# Altium project MEMESAT - PoBoI - Updated LTC.PrjPcb (part 1 of 2)
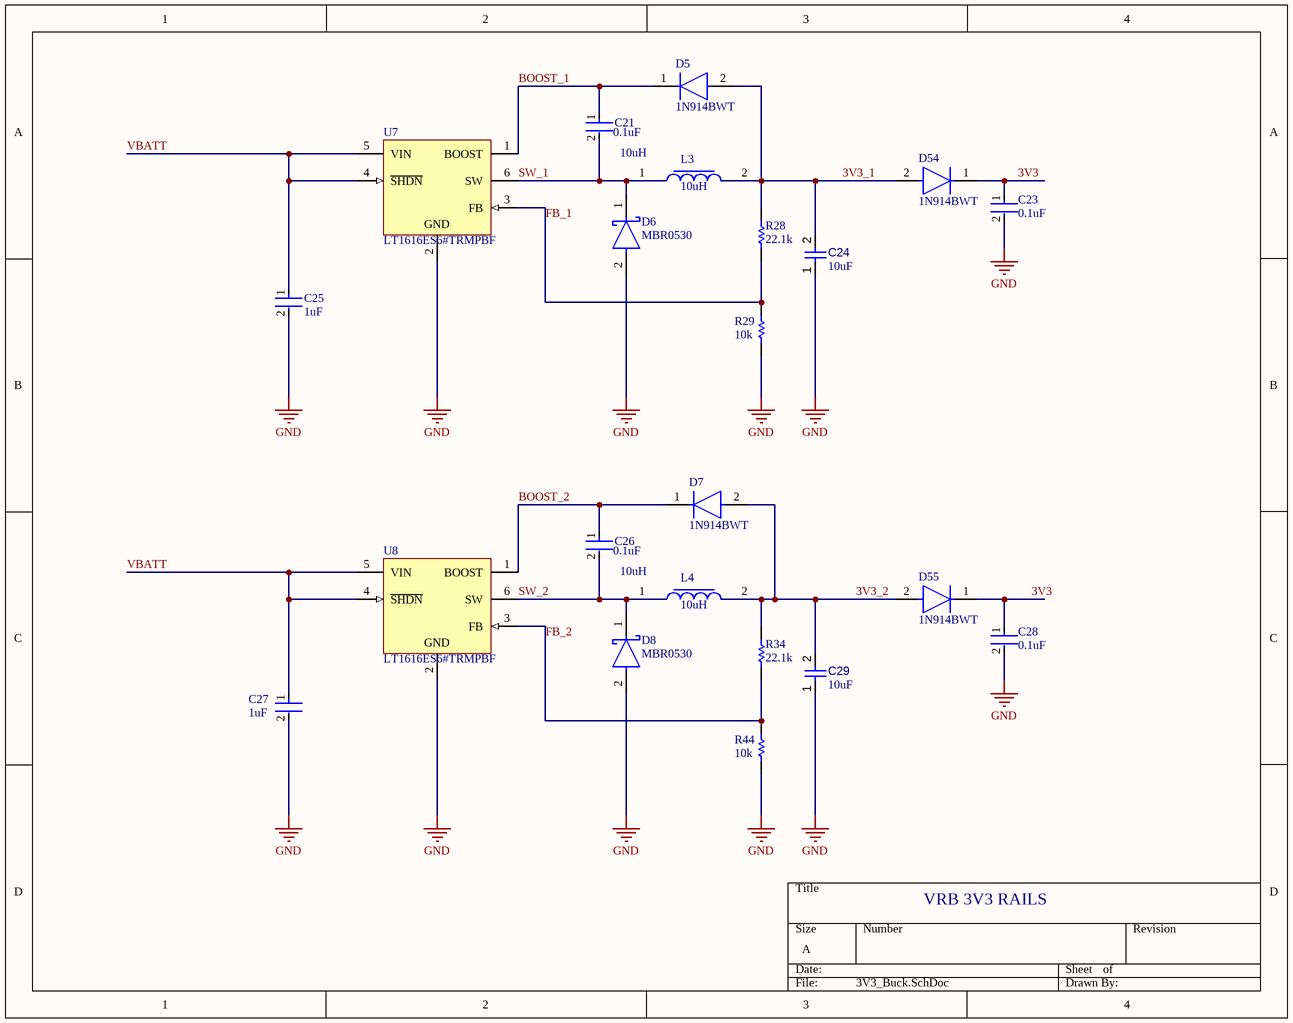
[diagram p0: 3V3_Buck.SchDoc]
12 sheets, 211 parts. Net scope: flat (ports and power ports of the same name join across sheets).
Board file: PoBoI.PcbDoc
Sheets:
  3V3_Buck.SchDoc
  3V3Primary.SchDoc
  3V3Secondary.SchDoc
  5V_Buck.SchDoc
  5VPrimary.SchDoc
  5VSecondary.SchDoc
  MemoryLatch.SchDoc
  PC104.SchDoc
  STM32.SchDoc
  VBATTPrimary.SchDoc
  VBATTSecondary.SchDoc
  WatchDog.SchDoc

## Sheet 3V3_Buck.SchDoc
size A; SheetNumber: 6; SheetTotal: 12; SPICEModelCacheKMHHWGDA: <root> / <DocumentId>KMHHWGDA</DocumentId> / <CacheFrame Number="0"> / <Model Name="lm317" Kind="CKT"> / <Text>*------------------------------------------------- / * POSITIVE ADJUSTABLE VOLTAGE REGULATOR / .SUBCKT LM317 IN ADJ OUT / JADJ IN ADJ ADJ JADJMOD / VREF 4 ADJ 1.250 / DBK IN 13 DMOD / CBC 13 15 800.0E-12 / RBC 15 5 1.000E3 / QPASS 13 5 OUT QPASSMOD / RB1 7 6 1 / RB2 6 5 128.3 / DSC 6 11 DMOD / ESC 11 OUT VALUE={5.646-.6667*V(6,5)*V(13,5)} / DFB 6 12 DMOD / EFB 12 OUT VALUE={8.822-.4024*V(13,5)+5.250E-3*V(13,5)*V(13,5) -.6667*V(13,5)*V(6,5)} / EB 7 OUT 8 OUT 6.939 / RP 9 8 100 / CPZ 10 OUT 3.183E-6 / DPU 10 OUT DMOD / RZ 8 10 .1 / EP 9 OUT 4 OUT 100 / RI OUT 4 100MEG / .MODEL QPASSMOD NPN (IS=30F BF=50 VAF=1.500 NF=1.701) / .MODEL JADJMOD NJF (BETA=50.00E-6 VTO=-1) / .MODEL DMOD D (IS=30F N=1.701) / .ENDS</Text> / </Model> / </CacheFrame> / </root>

### Parts
(Parts that share a designator on the sheet are numbered #1, #2 ... from top to bottom, then left to right.)
C21  0.1uF  [FP-C0603-CJ-MFG]
C23  0.1uF  [FP-C0603-CJ-MFG]
C24  value 10uF  [CAPC0603(1608)100_L]  (hidden comment: Capacitor 10µF +/-20% 10V 0603)
C25  1uF  [FP-CL10-IPC_B]
C26  0.1uF  [FP-C0603-CJ-MFG]
C27  1uF  [FP-CL10-IPC_B]
C28  0.1uF  [FP-C0603-CJ-MFG]
C29  value 10uF  [CAPC0603(1608)100_L]  (hidden comment: Capacitor 10µF +/-20% 10V 0603)
D5  1N914BWT  [FP-502-01-MFG]
D6  MBR0530  [FP-425-04-MFG]
D7  1N914BWT  [FP-502-01-MFG]
D8  MBR0530  [FP-425-04-MFG]
D54  1N914BWT  [FP-502-01-MFG]
D55  1N914BWT  [FP-502-01-MFG]
L3  Inductance: 10uH  [INDM3532X15N]  (hidden comment: PA4547.103NLT)
L4  Inductance: 10uH  [INDM3532X15N]  (hidden comment: PA4547.103NLT)
R28  22.1k  [RESC1609X50X30LL10T20]
R29  10k  [RESC1609X50X30NL8T20]
R34  22.1k  [RESC1609X50X30LL10T20]
R44#1  10k  [RESC1609X50X30NL8T20]
U7  LT1616ES6#TRMPBF  [LT-S6-6-SOT-23_M]
U8  LT1616ES6#TRMPBF  [LT-S6-6-SOT-23_M]

### Nets
GND: C23.2 C24.1 C25.2 C27.2 C28.2 C29.1 D6.2(A) D8.2(A) R29.1 R44#1.1 U7.2(GND) U8.2(GND)
3V3: C23.1 C28.1 D54.1(C) D55.1(C)
3V3_1: C24.2 D5.2(A) D54.2(A) L3.2 R28.2
3V3_2: C29.2 D7.2(A) D55.2(A) L4.2 R34.2
BOOST_1: C21.1 D5.1(C) U7.1(BOOST)
BOOST_2: C26.1 D7.1(C) U8.1(BOOST)
FB_1: R28.1 R29.2 U7.3(FB)
FB_2: R34.1 R44#1.2 U8.3(FB)
SW_1: C21.2 D6.1(C) L3.1 U7.6(SW)
SW_2: C26.2 D8.1(C) L4.1 U8.6(SW)
VBATT: C25.1 C27.1 U7.4(~{SHDN}) U7.5(VIN) U8.4(~{SHDN}) U8.5(VIN)

### Notes on the sheet
- (near L3) 10uH
- (near L4) 10uH
- VRB 3V3 RAILS

### Library data of the parts
C21 C23 C26 C28 = CMP-2006-03300-2: CAP CER 0.1UF 50V X7R 0603 / C0603X104K5RACTU; Manufacturer: Kemet; Capacitance: 100nF; Material: Ceramic; Tolerance: 10%; Value: 100nF; Temperature Coefficient: 15%; Temperature Range High: +125°C; Temperature Range Low: -55°C; Manufacturer Part Number: C0603X104K5RACTU; Voltage: 50V; ComponentLink2Description: Datasheet; RoHS: TRUE; ComponentLink2URL: https://content.kemet.com/datasheets/KEM_C1013_X7R_FT-CAP_SMD.pdf; Device Class L3: Ceramic Capacitors; Device Class L2: Capacitors; Package: C0603-CJ; Height: 0.95mm; Device Class L1: Passive Components; Temperature Characteristic: X7R; Lead Free: Yes; Digikey Description: CAP CER 0.1UF 50V X7R 0603; Automotive: No; Mouser Description: Capacitor; Ceramic; Cap 0.1uF; Tol+10%; SMT; Flexible Termination; Vol-Rtg 50V; TR; Temperature: -55°C to +125°C; Octopart: https://octopart.com/c0603x104k5ractu-kemet-9145062; Category: Cap; Voltage Rating: 50V; Ipc Land Pattern Name: CAPC16080X80
C24 C29 = CMP-001-00075-4: Chip Capacitor, 10µF +/-20%, 10V, 0603, Thickness 1 mm; Tolerance: 10%; Voltage Rating: 10V; Max Operating Temperature: 85°C; Pins: 2; Case/Package: 0603; Mounting Technology: SMT; Min Operating Temperature: -55°C
C25 C27 = CMP-13271-001107-1: Cap Ceramic 1uF 25V X7R ±10% Pad SMD 0603 +125°C T/R; Width: 0.031inch; Voltage Rating: 25V; Length: 0.063inch; Min Operating Temperature: -55°C; Package Quantity: 1; Tolerance: 10%; Case Code (Metric): 1608; Case/Package: 0603; Mount: Surface Mount; Thickness: 0.035inch; Lead Free: Lead Free; Case Code (Imperial): 0603; Capacitance: 1uF; Depth: 0.8mm; Dielectric: X7R; Max Operating Temperature: 125°C; Radiation Hardening: No; Packaging: Tape and Reel; Height: 0.8mm
D5 D7 D54 D55 = CMP-07163-000008-1: DIODE GEN PURP 75V 200MA SOD523F; Manufacturer: ON Semiconductor; Forward Current: 300mA; Capacitance: 4pF; Max Junction Temp: +150°C; Reverse Voltage: 100V; Value: 4pF; Peak Reverse Current: 5uA; ComponentLink2Description: Datasheet; Package: 502-01; Manufacturer Part Number: 1N914BWT; Digikey Description: DIODE GEN PURP 75V 200MA SOD523F; Temperature Range High: +150°C; Temperature: -55°C to +150°C; Footprint Url: https://www.onsemi.com/pub/Collateral/502-01.PDF; Device Class L2: Diodes; Lead Free: Yes; Automotive: No; Category: Diode; Octopart: https://octopart.com/1n914bwt-on+semiconductor-84323166; Device Class L1: Discrete Semiconductors; Ipc Land Pattern Name: SODFL16080X60; Device Class L3: Rectifier Diodes; Height: 0.7mm; Max Repetitive Reverse Voltage: 75V; Mouser Description: Diodes - General Purpose, Power, Switching SINGLE JUNC. 100V 4.0NS COMP; Temperature Range Low: -55°C; ComponentLink2URL: https://www.onsemi.com/pub/Collateral/1N914BWT-D.pdf; RoHS: TRUE
D6 D8 = CMP-2000-05113-2: DIODE SCHOTTKY 30V 500MA SOD123; Polarity: Standard; Max Reverse Leakage Current: 130uA; Forward Voltage: 430mV; Element Configuration: Single; Peak Non-Repetitive Surge Current: 5.5A; REACH SVHC: No SVHC; Contact Plating: Tin; Width: 1.6mm; Weight: 0.03g; Max Reverse Voltage (DC): 30V; Mount: Surface Mount; Max Repetitive Reverse Voltage (Vrrm): 30V; Number of Pins: 2; Height: 1.03mm; Current Rating: 500mA; Max Forward Surge Current (Ifsm): 5.5A; Lead Free: Lead Free; Max Surge Current: 5.5A; Peak Reverse Current: 130uA; Min Operating Temperature: -65°C; Radiation Hardening: No; Max Operating Temperature: 150°C; Average Rectified Current: 500mA; Packaging: Tape and Reel; Length: 2.7mm; Forward Current: 500mA; Voltage Rating (DC): 30V; Package Quantity: 1; Output Current: 500mA; Part Number: *
L3 L4 = CMP-006-00022-2: Inductor Power Molded Wirewound 10uH 20% 100KHz 1.2A 0.522Ohm DCR Automotive T/R; DC Resistance MAX: 522 mOhms; Rated Current: 1.20A; Saturation Current: 1.6A; DC Resistance Typical: 435 mOhms
R28 R34 = CMP-2000-03094-1: Part Number: CRCW060322K1FKEA; Manufacturer: Vishay Dale
R29 R44#1 = CMP-1666-00005-4: Chip Resistor, 10 KOhm, +/- 1%, 100 mW, -55 to 155 degC, 0603 (1608 Metric), RoHS, Tape and Reel / CRCW060310K0FKEA; Manufacturer: Vishay Semiconductor; Voltage Rating: 75 V; Value: 1K; Max Operating Temperature: 155 degC; PackageDescription: 2-Pin Surface Mount Device, Body 1.575 x 0.85 mm; ComponentLink1Description: Manufacturer URL; RoHSCompliant: true; PackageReference: 0603; REACH SVHC: Unknown; Length: 1.55 mm; DatasheetVersion: 06/2012; Packaging: Tape and Reel; Min Operating Temperature: -55 degC; Mounting Technology: Surface Mount; ComponentLink2URL: https://datasheet.ciiva.com/11809/0900766b80d98afc-11809037.pdf; Height: 0.45 mm; ComponentLink2Description: Datasheet; Package Quantity: 5000; ComponentLink1URL: http://www.vishay.com/
U7 U8 = CMP-0491-01627-1: 600 mA, 1.4 MHz Step-Down Switching Regulator, 6-pin SOT23 (S6-6), -40 to 85 degC, Pb-Free, Mini Tape and Reel; Manufacturer: Linear Technology; Number of Outputs: 1; PackageDescription: 6-Pin Plastic SOT-23, Body 1.625 x 2.9 mm, Pitch 0.95 mm; ComponentLink1Description: Manufacturer URL; Mounting Technology: Surface Mount; PackageVersion: Aug-07; ComponentLink3Description: Package Specification; PackageReference: S6-6; RoHS: TRUE; ComponentLink1URL: http://www.linear.com/; ComponentLink2Description: Datasheet; Packing: Mini Tape and Reel; PartNumber: LT1616ES6#TRMPBF; ComponentLink2URL: http://cds.linear.com/docs/en/datasheet/lt1616fs.pdf; ComponentLink3URL: http://cds.linear.com/docs/en/datasheet/175435f.pdf

## Sheet 3V3Primary.SchDoc
size A; SheetNumber: 13; SheetTotal: 18
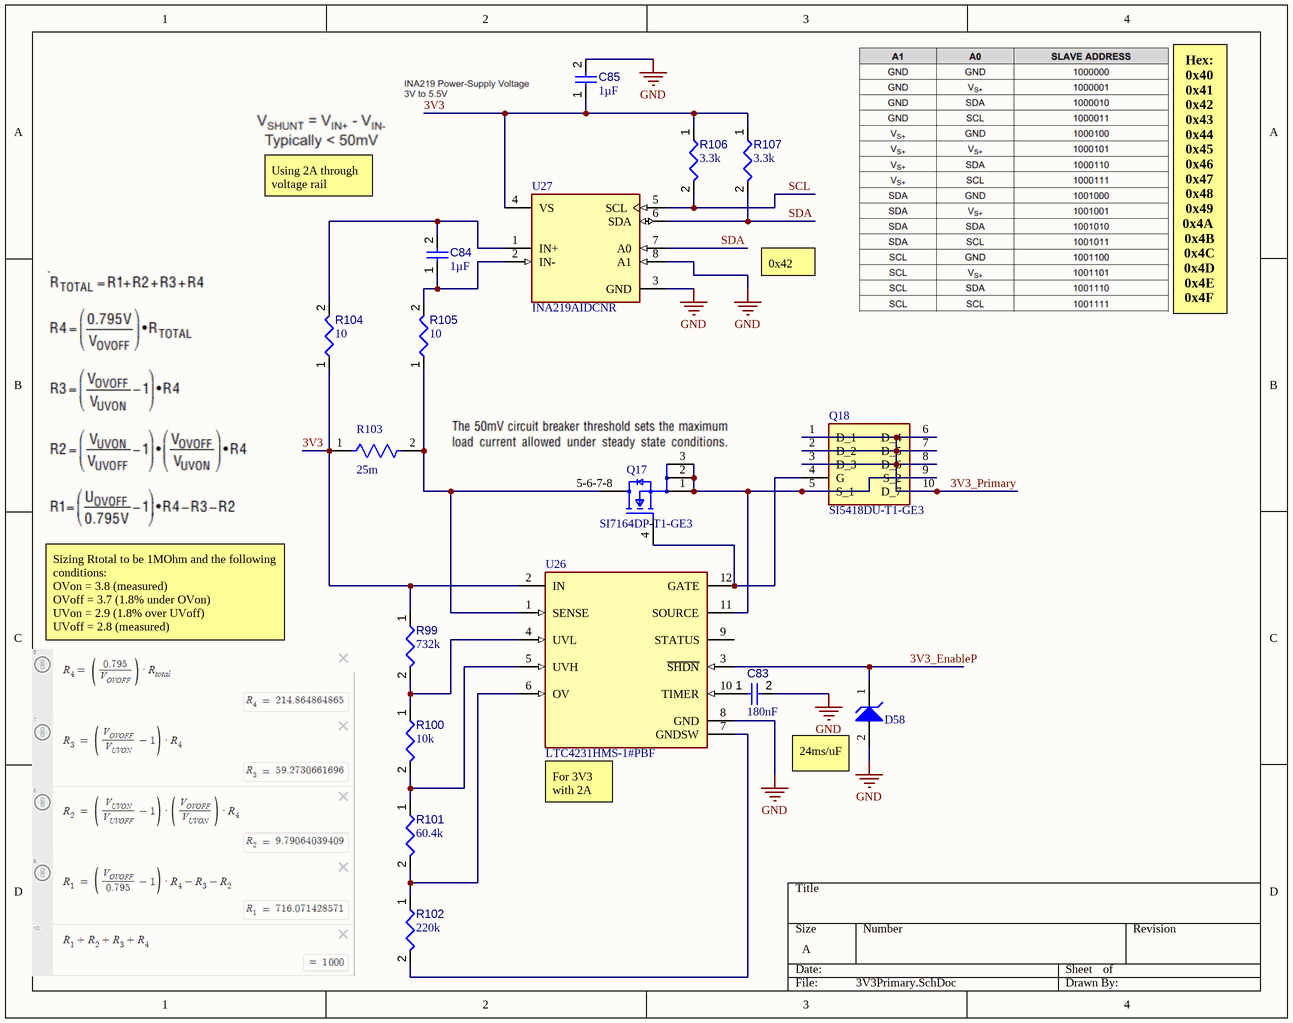
[diagram p1: 3V3Primary.SchDoc]

### Parts
C83  value 180nF  [FP-C0805C-DN-IPC_A]  (hidden comment: C0805C184K5RACTU)
C84  value 1µF  [CAPC1608X90X40LL10T20]  (hidden comment: Capacitor 1 uF +/- 10% 25 V 0603)
C85  value 1µF  [CAPC1608X90X35ML15T15]  (hidden comment: Capacitor 1uF +/- 10% 16V 0603)
D58  MM3Z3V6T1G  [ONSC-SOD-323-2-477-02_V]  (value not drawn)
Q17  SI7164DP-T1-GE3  [Vishay_S17-0173-SINGLE_MFG]
Q18  SI5418DU-T1-GE3  [SI5418DU-T1-GE3-Footprint-1]
R99  value 732k  [FP-CR0805-IPC_A]  (hidden comment: CR0805-FX-7323ELF)
R100  value 10k  [RESC1005X40X25ML05T05]  (hidden comment: Resistor 10k +/-1% 0402 100 mW)
R101  value 60.4k  [RESC1005X40X25NL05T10]  (hidden comment: RC0402FR-0760K4L)
R102  value 220k  [FP-ESR01-IPC_C]  (hidden comment: ESR01MZPJ224)
R103  Resistance: 25m  [FP-CSR1206-IPC_C]  (hidden comment: CSR1206FK25L0)
R104  value 10  [RESC0402(1005)_L]  (hidden comment: Resistor 10R  +/-1 % 0402 63 mW)
R105  value 10  [RESC0402(1005)_L]  (hidden comment: Resistor 10R  +/-1 % 0402 63 mW)
R106  value 3.3k  [FP-CRCW1210-e3-IPC_C]  (hidden comment: CRCW12103K30JNEA)
R107  value 3.3k  [FP-CRCW1210-e3-IPC_C]  (hidden comment: CRCW12103K30JNEA)
U26  LTC4231HMS-1#PBF  [FP-MS-12-05-08-1668-MFG]
U27  INA219AIDCNR  [FP-DCN0008A-IPC_A]

### Nets
GND: C83.2 C85.2 D58.2(A) U26.8(GND) U27.3(GND) U27.8(A1)
3V3: C85.1 R99.1 R103.1 R104.1 R106.1 R107.1 U26.2(IN) U27.4(VS)
3V3_EnableP: D58.1(K) U26.3(~{SHDN})
3V3_Primary: Q18.1(D_1) Q18.2(D_2) Q18.3(D_3) Q18.6(D_4) Q18.7(D_5) Q18.8(D_6) Q18.10(D_7)
SCL: R106.2 U27.5(SCL)
SDA: R107.2 U27.6(SDA) U27.7(A0)
NetC83_1: C83.1 U26.10(TIMER)
NetC84_1: C84.1 R105.2 U27.2(IN-)
NetC84_2: C84.2 R104.2 U27.1(IN+)
NetQ17_1: Q17.1(S) Q17.2(S) Q17.3(S) Q18.5(S_1) Q18.9(S_2) U26.11(SOURCE)
NetQ17_4: Q17.4(G) Q18.4(G) U26.12(GATE)
NetQ17_5-6-7-8: Q17.5-6-7-8(D) R103.2 R105.1 U26.1(SENSE)
NetR99_2: R99.2 R100.1 U26.4(UVL)
NetR100_2: R100.2 R101.1 U26.5(UVH)
NetR101_2: R101.2 R102.1 U26.6(OV)
NetR102_2: R102.2 U26.7(GNDSW)

Not connected (* = marked no-connect by the designer): U26 9(STATUS)

### Notes on the sheet
- Using 2A through voltage rail
- 0x42
- Hex:
  0x40
  0x41
  0x42
  0x43
  0x44
  0x45
  0x46
  0x47
  0x48
  0x49
  0x4A
  0x4B
  0x4C
  0x4D
  0x4E
  0x4F
- Sizing Rtotal to be 1MOhm and the following conditions:
  OVon = 3.8 (measured)
  OVoff = 3.7 (1.8% under OVon)
  UVon = 2.9 (1.8% over UVoff)
  UVoff = 2.8 (measured)
- (near D58) 24ms/uF
- (near U26) For 3V3
  with 2A

### Library data of the parts
C83 = CMP-001-00086-1: Ceramic Capacitor, Multilayer, Ceramic, 50V, 10% +Tol, 10% -Tol, X7R, 15% TC, 0.18uF, Surface Mount, 0805; Capacitor Type: Ceramic; Mounting Technology: Surface Mount; Pins: 2; Min Operating Temperature: -55°C; Case/Package: 0805; Max Operating Temperature: 125°C; RoHS Compliant: Yes
C84 = CMP-001-00005-6: Chip Capacitor, 1 uF, +/- 10%, 25 V, 0603 (1608 Metric); Capacitor Type: Ceramic; Voltage Rating: 25V; Pins: 2; Mounting Technology: SM; RoHS Compliant: True; Max Operating Temperature: 125°C; Case/Package: 0603; Min Operating Temperature: -55°C; Tolerance: 10%
C85 = CMP-001-00004-6: Chip Capacitor, 1 uF, +/- 10%, 16 V, 0603 (1608 Metric); Capacitor Type: Ceramic; Mounting Technology: SM; RoHS Compliant: True; Min Operating Temperature: -55°C; Case/Package: 0603; Pins: 2; Voltage Rating: 16V; Max Operating Temperature: 125°C; Tolerance: 10%
D58 = CMP-1060-00650-1: Zener Voltage Regulator, 300 mW, 2-Pin SOD-323, Pb-Free, Tape and Reel; Manufacturer: On Semiconductor; VZ Typ (V): 3.6; P Max (W): 0.3; RoHS: Pb-Free; ComponentLink1URL: http://www.onsemi.com/; PackageVersion: Rev. H, 03/2007; PartNumber: MM3Z3V6T1G; ComponentLink2Description: Datasheet; ComponentLink2URL: http://www.onsemi.cn/pub_link/Collateral/MM3Z2V4T1-D.PDF; DatasheetVersion: Rev. 9; PackageReference: SOD-323-2-477-02; ComponentLink3URL: http://www.onsemi.com/pub_link/Collateral/477-02.PDF.1; Packing: Tape and Reel; Mounting Technology: Surface Mount; ComponentLink3Description: Package Specification; PackageDescription: 2-Pin SOD, Body 1.7 x 1.25 mm; ComponentLink1Description: Manufacturer URL
Q17 = CMP-013-00040-1: Power Field-Effect Transistor, 23.5A I(D), 60V, 0.00625ohm, 1-Element, N-Channel, Silicon, Metal-oxide Semiconductor FET; Pins: 5; RoHS Compliant: Yes; Max Operating Temperature: 150°C
Q18 = CMP-013-00041-1: Power Field-Effect Transistor, 11.6A I(D), 30V, 0.0145ohm, 1-Element, N-Channel, Silicon, Metal-oxide Semiconductor FET; Max Operating Temperature: 150°C; RoHS Compliant: Yes; Pins: 3
R99 = CMP-009-00197-1: Fixed Resistor, Metal Glaze/thick Film, 0.125W, 732000ohm, 150V, 1% +/-Tol, 100ppm/Cel, Surface Mount, 0805; Power: 125mW; Case/Package: 0805; RoHS Compliant: Yes; Min Operating Temperature: -55°C; Max Operating Temperature: 155°C; Mounting Technology: Surface Mount; Pins: 2; Tolerance: 1%
R100 = CMP-009-00015-5: Chip Resistor, 10 KOhm, +/- 1%, 0.1 W, -55 to 155 degC, 0402 (1005 Metric); Voltage Rating: 50V; Power: 100mW; Case/Package: 0402; RoHS Compliant: True; Min Operating Temperature: -55°C; Mounting Technology: SM; Tolerance: 1%; Max Operating Temperature: 155°C; Pins: 2
R101 = CMP-009-00202-1: Fixed Resistor, Metal Glaze/thick Film, 0.0625W, 60400ohm, 50V, 1% +/-Tol, 100ppm/Cel, Surface Mount, 0402; Power: 62.5mW; Case/Package: 0402; Tolerance: 1%; RoHS Compliant: Yes; Max Operating Temperature: 155°C; Pins: 2; Mounting Technology: Surface Mount; Min Operating Temperature: -55°C
R102 = CMP-009-00204-1: Fixed Resistor, Metal Glaze/thick Film, 0.2W, 220000ohm, 50V, 5% +/-Tol, 200ppm/Cel, Surface Mount, 0402; Power: 200mW; Max Operating Temperature: 155°C; Tolerance: 5%; RoHS Compliant: Yes; Pins: 2; Mounting Technology: Surface Mount; Case/Package: 0402; Min Operating Temperature: -55°C
R103 = CMP-26527-000133-1: General Purpose Thick Film Chip Resistor, 1206, 25mΩ, 1%, 0.5W; Max Power Dissipation: 500mW; Temperature Coefficient: 100ppm/°C; Lead Free: Lead Free; Military Standard: Not; Case Code (Imperial): 1206; Max Operating Temperature: 155°C; Case Code (Metric): 3216; Height: 0.026inch; Packaging: Tape and Reel; Case/Package: 1206; Series: CSR; Number of Terminations: 2; RoHS Compliant: Yes; Mount: Surface Mount; Depth: 1.55mm; Contact Plating: Tin; Length: 0.12inch; Radiation Hardening: No; Width: 0.061inch; Size Code: 1206; Power Rating: 500mW; Min Operating Temperature: -55°C; Tolerance: 1%; Resistor Type: Thick Film; Construction: Rectangular
R104 R105 = CMP-009-00152-3: Chip Resistor, 10 Ohms, +/-1 %, 63 mW, -55 to 155 degC, 0402; Tolerance: 1%; Power: 63mW; Pins: 2; Max Operating Temperature: 155°C; Min Operating Temperature: -55°C; Case/Package: 0402
R106 R107 = CMP-009-00192-1: Fixed Resistor, Metal Glaze/thick Film, 0.5W, 3300ohm, 200V, 5% +/-Tol, 200ppm/Cel, Surface Mount, 1210; Power: 500mW; RoHS Compliant: Yes; Max Operating Temperature: 155°C; Case/Package: 1210; Min Operating Temperature: -55°C; Mounting Technology: Surface Mount; Tolerance: 5%; Pins: 2
U26 = CMP-09134-000012-1: IC HOT SWAP CTRLR GP 12MSOP; Operating Supply Current: 4uA; Number of Channels: 1; Min Supply Voltage: 2.7V; Max Supply Voltage: 36V; Number of Pins: 12; Features: Latched Fault; Max Operating Temperature: 125°C; Mount: Surface Mount; Packaging: Rail/Tube; Min Operating Temperature: -40°C; REACH SVHC: No SVHC; Case/Package: MSOP; RoHS Compliant: Yes
U27 = CMP-010-00025-1: Power Supply Support Circuit, Fixed, 2 Channel, 2V, PDSO8; Nominal Supply Voltage: 3.3V; Max Supply Voltage: 5.5V; Min Supply Voltage: 3V; Case/Package: LSSOP; Max Operating Temperature: 125°C; Min Operating Temperature: -40°C; Pins: 8; RoHS Compliant: Yes

## Sheet 3V3Secondary.SchDoc
size A; SheetNumber: 14; SheetTotal: 18
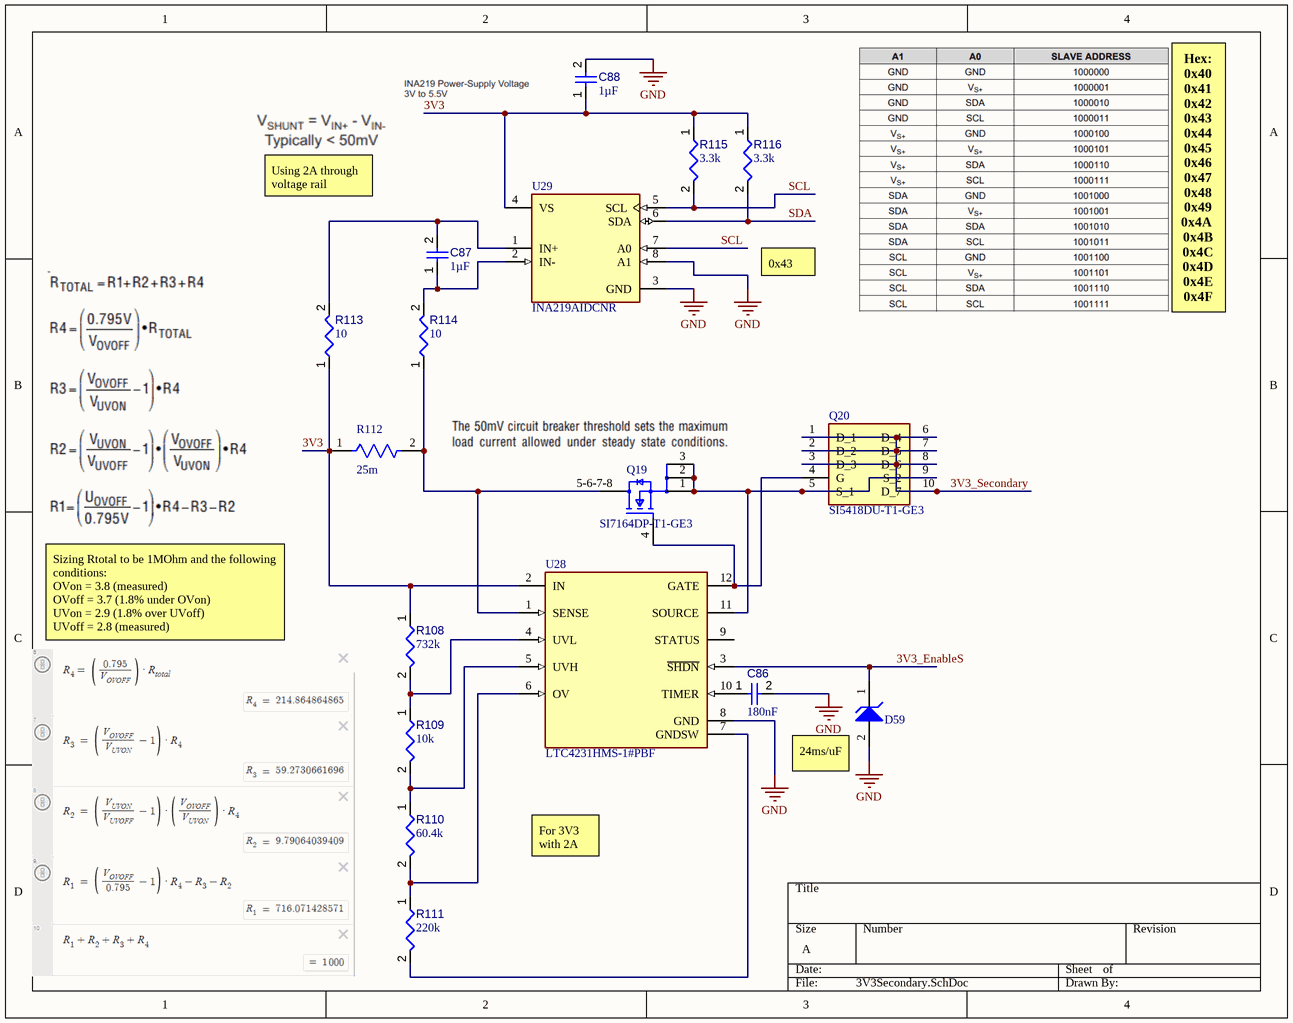
[diagram p2: 3V3Secondary.SchDoc]

### Parts
C86  value 180nF  [FP-C0805C-DN-IPC_A]  (hidden comment: C0805C184K5RACTU)
C87  value 1µF  [CAPC1608X90X40LL10T20]  (hidden comment: Capacitor 1 uF +/- 10% 25 V 0603)
C88  value 1µF  [CAPC1608X90X35ML15T15]  (hidden comment: Capacitor 1uF +/- 10% 16V 0603)
D59  MM3Z3V6T1G  [ONSC-SOD-323-2-477-02_V]  (value not drawn)
Q19  SI7164DP-T1-GE3  [Vishay_S17-0173-SINGLE_MFG]
Q20  SI5418DU-T1-GE3  [SI5418DU-T1-GE3-Footprint-1]
R108  value 732k  [FP-CR0805-IPC_A]  (hidden comment: CR0805-FX-7323ELF)
R109  value 10k  [RESC1005X40X25ML05T05]  (hidden comment: Resistor 10k +/-1% 0402 100 mW)
R110  value 60.4k  [RESC1005X40X25NL05T10]  (hidden comment: RC0402FR-0760K4L)
R111  value 220k  [FP-ESR01-IPC_C]  (hidden comment: ESR01MZPJ224)
R112  Resistance: 25m  [FP-CSR1206-IPC_C]  (hidden comment: CSR1206FK25L0)
R113  value 10  [RESC0402(1005)_L]  (hidden comment: Resistor 10R  +/-1 % 0402 63 mW)
R114  value 10  [RESC0402(1005)_L]  (hidden comment: Resistor 10R  +/-1 % 0402 63 mW)
R115  value 3.3k  [FP-CRCW1210-e3-IPC_C]  (hidden comment: CRCW12103K30JNEA)
R116  value 3.3k  [FP-CRCW1210-e3-IPC_C]  (hidden comment: CRCW12103K30JNEA)
U28  LTC4231HMS-1#PBF  [FP-MS-12-05-08-1668-MFG]
U29  INA219AIDCNR  [FP-DCN0008A-IPC_A]

### Nets
GND: C86.2 C88.2 D59.2(A) U28.8(GND) U29.3(GND) U29.8(A1)
3V3: C88.1 R108.1 R112.1 R113.1 R115.1 R116.1 U28.2(IN) U29.4(VS)
3V3_EnableS: D59.1(K) U28.3(~{SHDN})
3V3_Secondary: Q20.1(D_1) Q20.2(D_2) Q20.3(D_3) Q20.6(D_4) Q20.7(D_5) Q20.8(D_6) Q20.10(D_7)
SCL: R115.2 U29.5(SCL) U29.7(A0)
SDA: R116.2 U29.6(SDA)
NetC86_1: C86.1 U28.10(TIMER)
NetC87_1: C87.1 R114.2 U29.2(IN-)
NetC87_2: C87.2 R113.2 U29.1(IN+)
NetQ19_1: Q19.1(S) Q19.2(S) Q19.3(S) Q20.5(S_1) Q20.9(S_2) U28.11(SOURCE)
NetQ19_4: Q19.4(G) Q20.4(G) U28.12(GATE)
NetQ19_5-6-7-8: Q19.5-6-7-8(D) R112.2 R114.1 U28.1(SENSE)
NetR108_2: R108.2 R109.1 U28.4(UVL)
NetR109_2: R109.2 R110.1 U28.5(UVH)
NetR110_2: R110.2 R111.1 U28.6(OV)
NetR111_2: R111.2 U28.7(GNDSW)

Not connected (* = marked no-connect by the designer): U28 9(STATUS)

### Notes on the sheet
- Using 2A through voltage rail
- 0x43
- Hex:
  0x40
  0x41
  0x42
  0x43
  0x44
  0x45
  0x46
  0x47
  0x48
  0x49
  0x4A
  0x4B
  0x4C
  0x4D
  0x4E
  0x4F
- Sizing Rtotal to be 1MOhm and the following conditions:
  OVon = 3.8 (measured)
  OVoff = 3.7 (1.8% under OVon)
  UVon = 2.9 (1.8% over UVoff)
  UVoff = 2.8 (measured)
- (near D59) 24ms/uF
- For 3V3
  with 2A

### Library data of the parts
C86 = CMP-001-00086-1: as C83 on sheet 3V3Primary; Capacitor Type: Ceramic; Mounting Technology: Surface Mount; Pins: 2; Min Operating Temperature: -55°C; Case/Package: 0805; Max Operating Temperature: 125°C; RoHS Compliant: Yes
C87 = CMP-001-00005-6: as C84 on sheet 3V3Primary; Pins: 2; Mounting Technology: SM; RoHS Compliant: True; Max Operating Temperature: 125°C; Case/Package: 0603; Min Operating Temperature: -55°C; Tolerance: 10%
C88 = CMP-001-00004-6: as C85 on sheet 3V3Primary; Mounting Technology: SM; RoHS Compliant: True; Min Operating Temperature: -55°C; Case/Package: 0603; Pins: 2; Voltage Rating: 16V; Max Operating Temperature: 125°C; Tolerance: 10%
D59 = CMP-1060-00650-1: as D58 on sheet 3V3Primary; RoHS: Pb-Free; ComponentLink1URL: http://www.onsemi.com/; PackageVersion: Rev. H, 03/2007; PartNumber: MM3Z3V6T1G; ComponentLink2Description: Datasheet; ComponentLink2URL: http://www.onsemi.cn/pub_link/Collateral/MM3Z2V4T1-D.PDF; DatasheetVersion: Rev. 9; PackageReference: SOD-323-2-477-02; ComponentLink3URL: http://www.onsemi.com/pub_link/Collateral/477-02.PDF.1; Packing: Tape and Reel; Mounting Technology: Surface Mount; ComponentLink3Description: Package Specification; PackageDescription: 2-Pin SOD, Body 1.7 x 1.25 mm; ComponentLink1Description: Manufacturer URL
Q19 = CMP-013-00040-1: as Q17 on sheet 3V3Primary; Pins: 5; RoHS Compliant: Yes; Max Operating Temperature: 150°C
Q20 = CMP-013-00041-1: as Q18 on sheet 3V3Primary; Max Operating Temperature: 150°C; RoHS Compliant: Yes; Pins: 3
R108 = CMP-009-00197-1: as R99 on sheet 3V3Primary; Case/Package: 0805; RoHS Compliant: Yes; Min Operating Temperature: -55°C; Max Operating Temperature: 155°C; Mounting Technology: Surface Mount; Pins: 2; Tolerance: 1%
R109 = CMP-009-00015-5: as R100 on sheet 3V3Primary; Case/Package: 0402; RoHS Compliant: True; Min Operating Temperature: -55°C; Mounting Technology: SM; Tolerance: 1%; Max Operating Temperature: 155°C; Pins: 2
R110 = CMP-009-00202-1: as R101 on sheet 3V3Primary; Case/Package: 0402; Tolerance: 1%; RoHS Compliant: Yes; Max Operating Temperature: 155°C; Pins: 2; Mounting Technology: Surface Mount; Min Operating Temperature: -55°C
R111 = CMP-009-00204-1: as R102 on sheet 3V3Primary; Max Operating Temperature: 155°C; Tolerance: 5%; RoHS Compliant: Yes; Pins: 2; Mounting Technology: Surface Mount; Case/Package: 0402; Min Operating Temperature: -55°C
R112 = CMP-26527-000133-1: as R103 on sheet 3V3Primary; Lead Free: Lead Free; Military Standard: Not; Case Code (Imperial): 1206; Max Operating Temperature: 155°C; Case Code (Metric): 3216; Height: 0.026inch; Packaging: Tape and Reel; Case/Package: 1206; Series: CSR; Number of Terminations: 2; RoHS Compliant: Yes; Mount: Surface Mount; Depth: 1.55mm; Contact Plating: Tin; Length: 0.12inch; Radiation Hardening: No; Width: 0.061inch; Size Code: 1206; Power Rating: 500mW; Min Operating Temperature: -55°C; Tolerance: 1%; Resistor Type: Thick Film; Construction: Rectangular
R113 R114 = CMP-009-00152-3: as R104 on sheet 3V3Primary; Pins: 2; Max Operating Temperature: 155°C; Min Operating Temperature: -55°C; Case/Package: 0402
R115 R116 = CMP-009-00192-1: as R106 on sheet 3V3Primary; RoHS Compliant: Yes; Max Operating Temperature: 155°C; Case/Package: 1210; Min Operating Temperature: -55°C; Mounting Technology: Surface Mount; Tolerance: 5%; Pins: 2
U28 = CMP-09134-000012-1: as U26 on sheet 3V3Primary; Number of Pins: 12; Features: Latched Fault; Max Operating Temperature: 125°C; Mount: Surface Mount; Packaging: Rail/Tube; Min Operating Temperature: -40°C; REACH SVHC: No SVHC; Case/Package: MSOP; RoHS Compliant: Yes
U29 = CMP-010-00025-1: as U27 on sheet 3V3Primary; Case/Package: LSSOP; Max Operating Temperature: 125°C; Min Operating Temperature: -40°C; Pins: 8; RoHS Compliant: Yes

## Sheet 5V_Buck.SchDoc
size A; SheetNumber: 5; SheetTotal: 12; SPICEModelCacheVYLUUOOD: <root> / <DocumentId>VYLUUOOD</DocumentId> / <CacheFrame Number="0"> / <Model Name="lm317" Kind="CKT"> / <Text>*------------------------------------------------- / * POSITIVE ADJUSTABLE VOLTAGE REGULATOR / .SUBCKT LM317 IN ADJ OUT / JADJ IN ADJ ADJ JADJMOD / VREF 4 ADJ 1.250 / DBK IN 13 DMOD / CBC 13 15 800.0E-12 / RBC 15 5 1.000E3 / QPASS 13 5 OUT QPASSMOD / RB1 7 6 1 / RB2 6 5 128.3 / DSC 6 11 DMOD / ESC 11 OUT VALUE={5.646-.6667*V(6,5)*V(13,5)} / DFB 6 12 DMOD / EFB 12 OUT VALUE={8.822-.4024*V(13,5)+5.250E-3*V(13,5)*V(13,5) -.6667*V(13,5)*V(6,5)} / EB 7 OUT 8 OUT 6.939 / RP 9 8 100 / CPZ 10 OUT 3.183E-6 / DPU 10 OUT DMOD / RZ 8 10 .1 / EP 9 OUT 4 OUT 100 / RI OUT 4 100MEG / .MODEL QPASSMOD NPN (IS=30F BF=50 VAF=1.500 NF=1.701) / .MODEL JADJMOD NJF (BETA=50.00E-6 VTO=-1) / .MODEL DMOD D (IS=30F N=1.701) / .ENDS</Text> / </Model> / </CacheFrame> / </root>
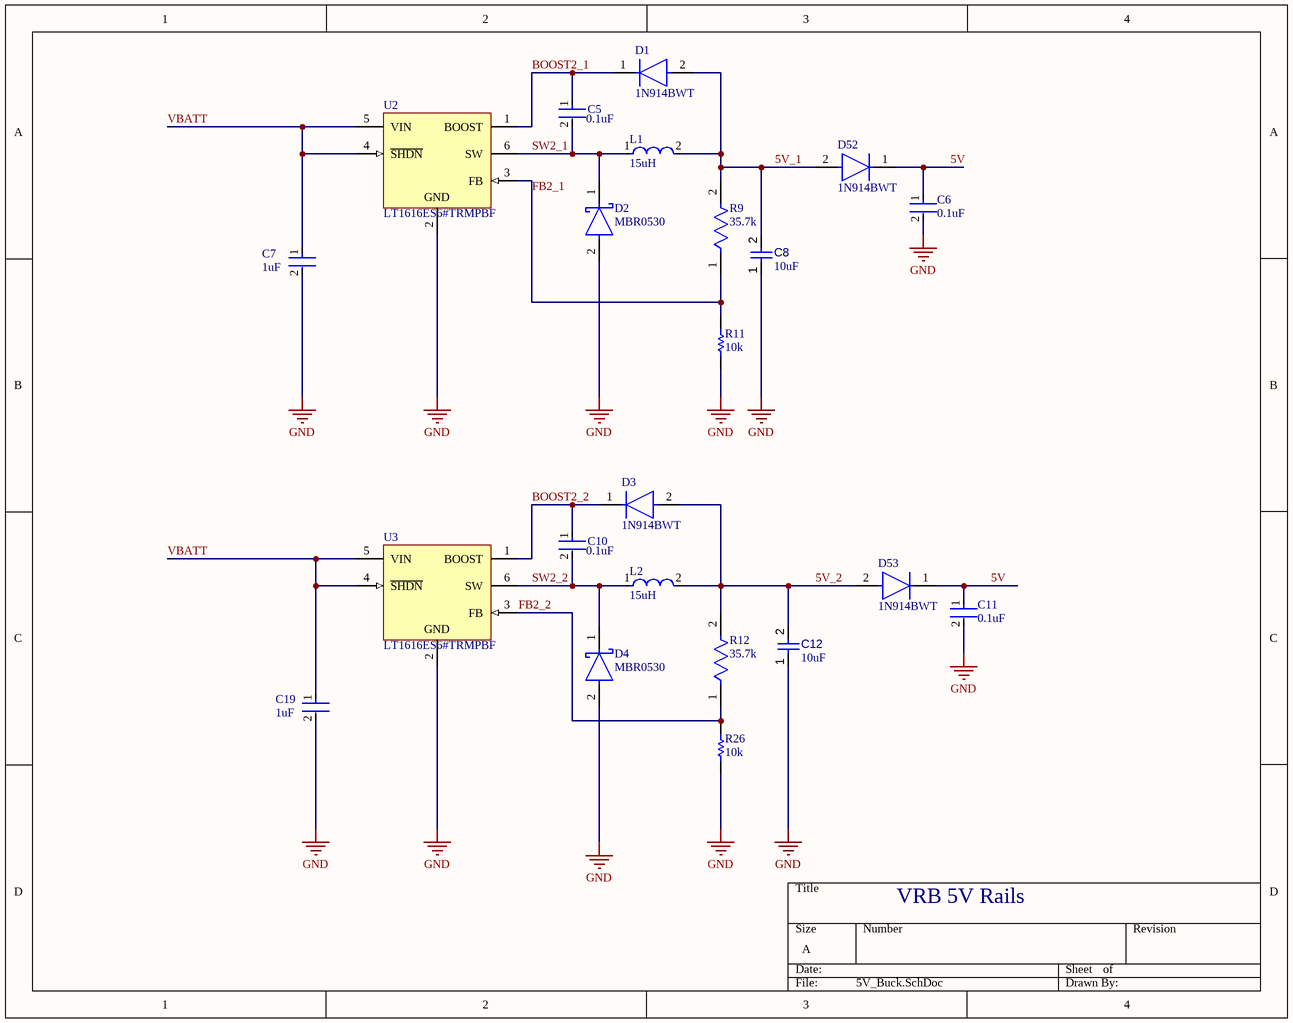
[diagram p3: 5V_Buck.SchDoc]

### Parts
C5  0.1uF  [FP-C0603-CJ-MFG]
C6  0.1uF  [FP-C0603-CJ-MFG]
C7  1uF  [FP-CL10-IPC_B]
C8  value 10uF  [CAPC0603(1608)100_L]  (hidden comment: Capacitor 10µF +/-20% 10V 0603)
C10  0.1uF  [FP-C0603-CJ-MFG]
C11  0.1uF  [FP-C0603-CJ-MFG]
C12  value 10uF  [CAPC0603(1608)100_L]  (hidden comment: Capacitor 10µF +/-20% 10V 0603)
C19  1uF  [FP-CL10-IPC_B]
D1  1N914BWT  [FP-502-01-MFG]
D2  MBR0530  [FP-425-04-MFG]
D3  1N914BWT  [FP-502-01-MFG]
D4  MBR0530  [FP-425-04-MFG]
D52  1N914BWT  [FP-502-01-MFG]
D53  1N914BWT  [FP-502-01-MFG]
L1  15uH  [FP-LQH43CN_03-MFG]
L2  15uH  [FP-LQH43CN_03-MFG]
R9  35.7k  [FP-CRCW0603-e3-IPC_C]
R11  10k  [RESC1609X50X30NL8T20]
R12  35.7k  [FP-CRCW0603-e3-IPC_C]
R26  10k  [RESC1609X50X30NL8T20]
U2  LT1616ES6#TRMPBF  [LT-S6-6-SOT-23_M]
U3  LT1616ES6#TRMPBF  [LT-S6-6-SOT-23_M]

### Nets
GND: C6.2 C7.2 C8.1 C11.2 C12.1 C19.2 D2.2(A) D4.2(A) R11.1 R26.1 U2.2(GND) U3.2(GND)
5V: C6.1 C11.1 D52.1(C) D53.1(C)
5V_1: C8.2 D1.2(A) D52.2(A) L1.2 R9.2
5V_2: C12.2 D3.2(A) D53.2(A) L2.2 R12.2
BOOST2_1: C5.1 D1.1(C) U2.1(BOOST)
BOOST2_2: C10.1 D3.1(C) U3.1(BOOST)
FB2_1: R9.1 R11.2 U2.3(FB)
FB2_2: R12.1 R26.2 U3.3(FB)
SW2_1: C5.2 D2.1(C) L1.1 U2.6(SW)
SW2_2: C10.2 D4.1(C) L2.1 U3.6(SW)
VBATT: C7.1 C19.1 U2.4(~{SHDN}) U2.5(VIN) U3.4(~{SHDN}) U3.5(VIN)

### Notes on the sheet
- VRB 5V Rails

### Library data of the parts
C5 C6 C10 C11 = CMP-2006-03300-2: as C21 on sheet 3V3_Buck; Temperature Range High: +125°C; Temperature Range Low: -55°C; Manufacturer Part Number: C0603X104K5RACTU; Voltage: 50V; ComponentLink2Description: Datasheet; RoHS: TRUE; ComponentLink2URL: https://content.kemet.com/datasheets/KEM_C1013_X7R_FT-CAP_SMD.pdf; Device Class L3: Ceramic Capacitors; Device Class L2: Capacitors; Package: C0603-CJ; Height: 0.95mm; Device Class L1: Passive Components; Temperature Characteristic: X7R; Lead Free: Yes; Digikey Description: CAP CER 0.1UF 50V X7R 0603; Automotive: No; Mouser Description: Capacitor; Ceramic; Cap 0.1uF; Tol+10%; SMT; Flexible Termination; Vol-Rtg 50V; TR; Temperature: -55°C to +125°C; Octopart: https://octopart.com/c0603x104k5ractu-kemet-9145062; Category: Cap; Voltage Rating: 50V; Ipc Land Pattern Name: CAPC16080X80
C7 C19 = CMP-13271-001107-1: Cap Ceramic 1uF 25V X7R ±10% Pad SMD 0603 +125°C T/R / CL10B105KA8NFNC; Width: 0.031inch; Voltage Rating: 25V; Length: 0.063inch; Min Operating Temperature: -55°C; Package Quantity: 1; Tolerance: 10%; Case Code (Metric): 1608; Case/Package: 0603; Mount: Surface Mount; Thickness: 0.035inch; Lead Free: Lead Free; Case Code (Imperial): 0603; Capacitance: 1uF; Depth: 0.8mm; Dielectric: X7R; Max Operating Temperature: 125°C; Radiation Hardening: No; Packaging: Tape and Reel; Height: 0.8mm
C8 C12 = CMP-001-00075-4: as C24 on sheet 3V3_Buck; Voltage Rating: 10V; Max Operating Temperature: 85°C; Pins: 2; Case/Package: 0603; Mounting Technology: SMT; Min Operating Temperature: -55°C
D1 D3 D52 D53 = CMP-07163-000008-1: as D5 on sheet 3V3_Buck; ComponentLink2Description: Datasheet; Package: 502-01; Manufacturer Part Number: 1N914BWT; Digikey Description: DIODE GEN PURP 75V 200MA SOD523F; Temperature Range High: +150°C; Temperature: -55°C to +150°C; Footprint Url: https://www.onsemi.com/pub/Collateral/502-01.PDF; Device Class L2: Diodes; Lead Free: Yes; Automotive: No; Category: Diode; Octopart: https://octopart.com/1n914bwt-on+semiconductor-84323166; Device Class L1: Discrete Semiconductors; Ipc Land Pattern Name: SODFL16080X60; Device Class L3: Rectifier Diodes; Height: 0.7mm; Max Repetitive Reverse Voltage: 75V; Mouser Description: Diodes - General Purpose, Power, Switching SINGLE JUNC. 100V 4.0NS COMP; Temperature Range Low: -55°C; ComponentLink2URL: https://www.onsemi.com/pub/Collateral/1N914BWT-D.pdf; RoHS: TRUE
D2 D4 = CMP-2000-05113-2: as D6 on sheet 3V3_Buck; REACH SVHC: No SVHC; Contact Plating: Tin; Width: 1.6mm; Weight: 0.03g; Max Reverse Voltage (DC): 30V; Mount: Surface Mount; Max Repetitive Reverse Voltage (Vrrm): 30V; Number of Pins: 2; Height: 1.03mm; Current Rating: 500mA; Max Forward Surge Current (Ifsm): 5.5A; Lead Free: Lead Free; Max Surge Current: 5.5A; Peak Reverse Current: 130uA; Min Operating Temperature: -65°C; Radiation Hardening: No; Max Operating Temperature: 150°C; Average Rectified Current: 500mA; Packaging: Tape and Reel; Length: 2.7mm; Forward Current: 500mA; Voltage Rating (DC): 30V; Package Quantity: 1; Output Current: 500mA
L1 L2 = CMP-06042-015693-1: Wire Wound Ferrite Inductor for General Circuits 15μH ±10% 0.73Ω 360mA 1812; Q Factor: 35; Test Frequency: 1MHz; Frequency: 19MHz; DC Resistance (DCR): 730mR; Shielding: Unshielded; Resistor Type: Wirewound; Case Code (Metric): 4532; Width: 3.2mm; Lead Free: Lead Free; Length: 4.5mm; Min Operating Temperature: -40°C; Height: 2.6mm; Military Standard: Not; Max Operating Temperature: 85°C; Self Resonant Frequency: 19MHz; Termination: SMD/SMT; Tolerance: 10%; DC Current: 360mA; Max DC Current: 360mA; Weight: 0.004586oz; Case Code (Imperial): 1812; Packaging: Tape and Reel; Series: LQH43M; Series Resistance: 730mR; Case/Package: 1812; Core Material: Ferrite; Current Rating: 360mA; Inductance: 15uH; Depth: 3.4mm; Mount: Surface Mount; Height - Seated (Max): 0.11inch; Radiation Hardening: No; Package Quantity: 500; Value: 15uH
R9 R12 = CMP-2000-03264-2: RES Thick Film, 35.7kΩ, 1%, 0.1W, 100ppm/°C, 0603; Max Power Dissipation: 100mW; Voltage Rating: 75V; Resistance: 35.7kR; Weight: 7.1E-05oz; Termination: Solder; Max Operating Temperature: 155°C; Military Standard: Not; Height: 0.45mm; Temperature Coefficient: 100ppm/°C; Contact Plating: Tin; Packaging: Tape and Reel; Radiation Hardening: No; Depth: 0.85mm; Number of Pins: 2; Length: 1.55mm; Composition: Thick Film; Case Code (Metric): 1608; Package Quantity: 10; Width: 0.033inch; Number of Terminations: 2; Power Rating: 100mW; Case/Package: 0603; Case Code (Imperial): 0603; Features: Automotive AEC-Q200; Tolerance: 1%; Min Operating Temperature: -55°C
R11 R26 = CMP-1666-00005-4: as R29 on sheet 3V3_Buck; Max Operating Temperature: 155 degC; PackageDescription: 2-Pin Surface Mount Device, Body 1.575 x 0.85 mm; ComponentLink1Description: Manufacturer URL; RoHSCompliant: true; PackageReference: 0603; REACH SVHC: Unknown; Length: 1.55 mm; DatasheetVersion: 06/2012; Packaging: Tape and Reel; Min Operating Temperature: -55 degC; Mounting Technology: Surface Mount; ComponentLink2URL: https://datasheet.ciiva.com/11809/0900766b80d98afc-11809037.pdf; Height: 0.45 mm; ComponentLink2Description: Datasheet; Package Quantity: 5000; ComponentLink1URL: http://www.vishay.com/
U2 U3 = CMP-0491-01627-1: as U7 on sheet 3V3_Buck; PackageDescription: 6-Pin Plastic SOT-23, Body 1.625 x 2.9 mm, Pitch 0.95 mm; ComponentLink1Description: Manufacturer URL; Mounting Technology: Surface Mount; PackageVersion: Aug-07; ComponentLink3Description: Package Specification; PackageReference: S6-6; RoHS: TRUE; ComponentLink1URL: http://www.linear.com/; ComponentLink2Description: Datasheet; Packing: Mini Tape and Reel; PartNumber: LT1616ES6#TRMPBF; ComponentLink2URL: http://cds.linear.com/docs/en/datasheet/lt1616fs.pdf; ComponentLink3URL: http://cds.linear.com/docs/en/datasheet/175435f.pdf

## Sheet 5VPrimary.SchDoc
size A; SheetNumber: 5; SheetTotal: 15
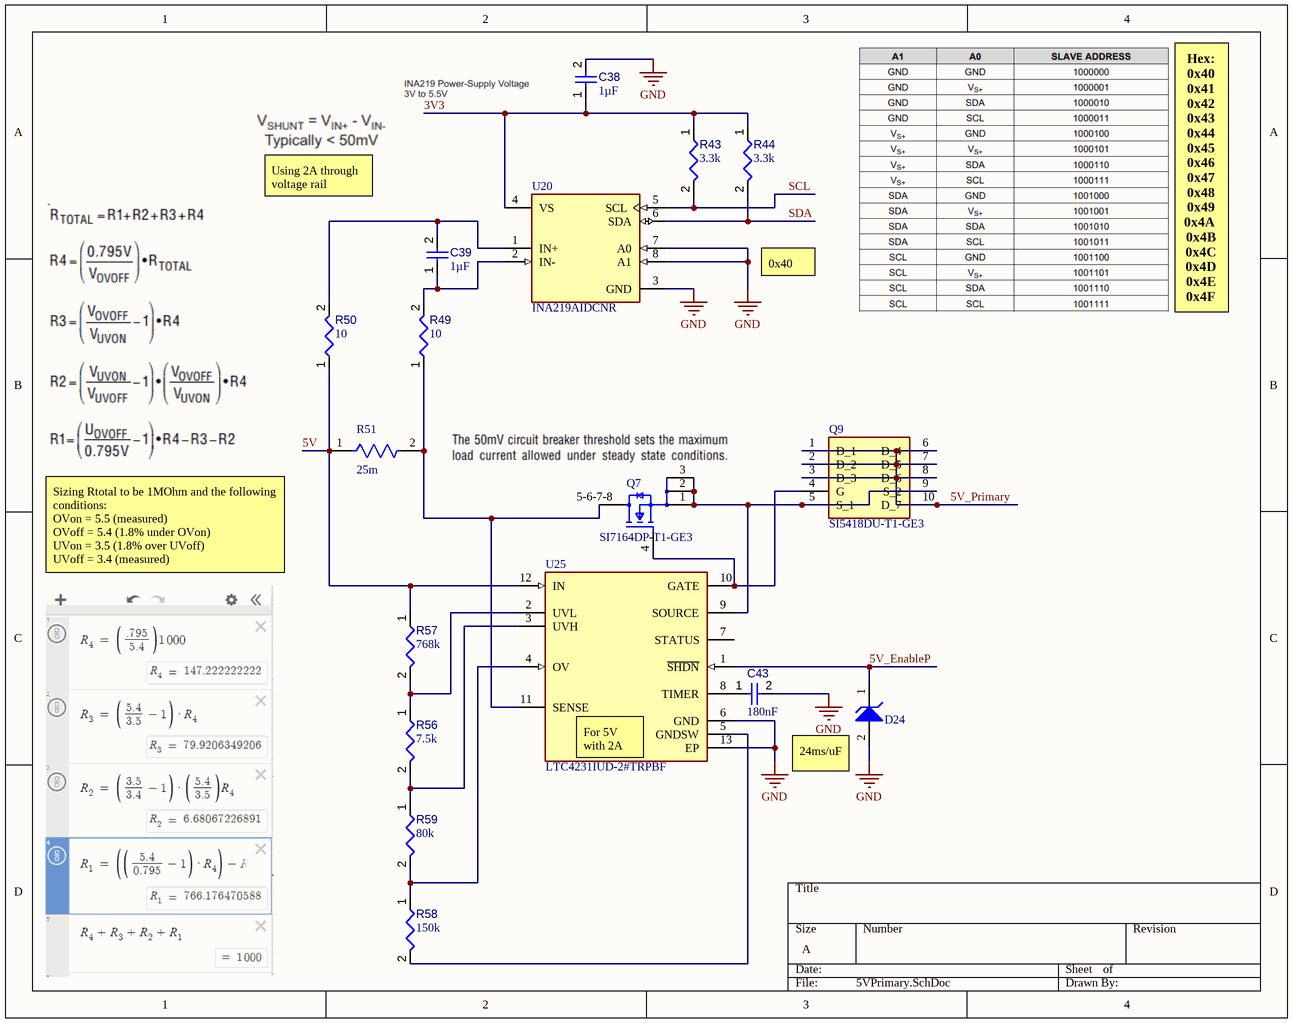
[diagram p4: 5VPrimary.SchDoc]

### Parts
(Parts that share a designator on the sheet are numbered #1, #2 ... from top to bottom, then left to right.)
C38  value 1µF  [CAPC1608X90X35ML15T15]  (hidden comment: Capacitor 1uF +/- 10% 16V 0603)
C39  value 1µF  [CAPC1608X90X40LL10T20]  (hidden comment: Capacitor 1 uF +/- 10% 25 V 0603)
C43  value 180nF  [FP-C0805C-DN-IPC_A]  (hidden comment: C0805C184K5RACTU)
D24  MM3Z3V6T1G  [ONSC-SOD-323-2-477-02_V]  (value not drawn)
Q7  SI7164DP-T1-GE3  [Vishay_S17-0173-SINGLE_MFG]
Q9  SI5418DU-T1-GE3  [SI5418DU-T1-GE3-Footprint-1]
R43  value 3.3k  [FP-CRCW1210-e3-IPC_C]  (hidden comment: CRCW12103K30JNEA)
R44#2  value 3.3k  [FP-CRCW1210-e3-IPC_C]  (hidden comment: CRCW12103K30JNEA)
R49  value 10  [RESC0402(1005)_L]  (hidden comment: Resistor 10R  +/-1 % 0402 63 mW)
R50  value 10  [RESC0402(1005)_L]  (hidden comment: Resistor 10R  +/-1 % 0402 63 mW)
R51  Resistance: 25m  [FP-CSR1206-IPC_C]  (hidden comment: CSR1206FK25L0)
R56  value 7.5k  [FP-CRCW1206-e3-IPC_A]  (hidden comment: CRCW12067K50FKEA)
R57  value 768k  [RESC0402(1005)_L]  (hidden comment: 768KR2F)
R58  value 150k  [FP-RT1206-IPC_C]  (hidden comment: RT1206FRE07150KL)
R59  value 80k  [FP-PTN0603-IPC_B]  (hidden comment: PTN0603E8002BST1)
U20  INA219AIDCNR  [FP-DCN0008A-IPC_A]
U25#1  LTC4231IUD-2#TRPBF  [FP-UD-12-05-08-1855-IPC_A]

### Nets
GND: C38.2 C43.2 D24.2(A) U20.3(GND) U20.7(A0) U20.8(A1) U25#1.6(GND) U25#1.13(EP)
3V3: C38.1 R43.1 R44#2.1 U20.4(VS)
5V: R50.1 R51.1 R57.1 U25#1.12(IN)
5V_EnableP: D24.1(K) U25#1.1(~{SHDN})
5V_Primary: Q9.1(D_1) Q9.2(D_2) Q9.3(D_3) Q9.6(D_4) Q9.7(D_5) Q9.8(D_6) Q9.10(D_7)
SCL: R43.2 U20.5(SCL)
SDA: R44#2.2 U20.6(SDA)
NetC39_1: C39.1 R49.2 U20.2(IN-)
NetC39_2: C39.2 R50.2 U20.1(IN+)
NetC43_1: C43.1 U25#1.8(TIMER)
NetQ7_1: Q7.1(S) Q7.2(S) Q7.3(S) Q9.5(S_1) Q9.9(S_2) U25#1.9(SOURCE)
NetQ7_4: Q7.4(G) Q9.4(G) U25#1.10(GATE)
NetQ7_5-6-7-8: Q7.5-6-7-8(D) R49.1 R51.2 U25#1.11(SENSE)
NetR56_1: R56.1 R57.2 U25#1.2(UVL)
NetR56_2: R56.2 R59.1 U25#1.3(UVH)
NetR58_1: R58.1 R59.2 U25#1.4(OV)
NetR58_2: R58.2 U25#1.5(GNDSW)

Not connected (* = marked no-connect by the designer): U25#1 7(STATUS)

### Notes on the sheet
- Using 2A through voltage rail
- 0x40
- Hex:
  0x40
  0x41
  0x42
  0x43
  0x44
  0x45
  0x46
  0x47
  0x48
  0x49
  0x4A
  0x4B
  0x4C
  0x4D
  0x4E
  0x4F
- Sizing Rtotal to be 1MOhm and the following conditions:
  OVon = 5.5 (measured)
  OVoff = 5.4 (1.8% under OVon)
  UVon = 3.5 (1.8% over UVoff)
  UVoff = 3.4 (measured)
- (near U25#1) For 5V
  with 2A
- (near D24) 24ms/uF

### Library data of the parts
C38 = CMP-001-00004-6: as C85 on sheet 3V3Primary; Mounting Technology: SM; RoHS Compliant: True; Min Operating Temperature: -55°C; Case/Package: 0603; Pins: 2; Voltage Rating: 16V; Max Operating Temperature: 125°C; Tolerance: 10%
C39 = CMP-001-00005-6: as C84 on sheet 3V3Primary; Pins: 2; Mounting Technology: SM; RoHS Compliant: True; Max Operating Temperature: 125°C; Case/Package: 0603; Min Operating Temperature: -55°C; Tolerance: 10%
C43 = CMP-001-00086-1: as C83 on sheet 3V3Primary; Capacitor Type: Ceramic; Mounting Technology: Surface Mount; Pins: 2; Min Operating Temperature: -55°C; Case/Package: 0805; Max Operating Temperature: 125°C; RoHS Compliant: Yes
D24 = CMP-1060-00650-1: as D58 on sheet 3V3Primary; RoHS: Pb-Free; ComponentLink1URL: http://www.onsemi.com/; PackageVersion: Rev. H, 03/2007; PartNumber: MM3Z3V6T1G; ComponentLink2Description: Datasheet; ComponentLink2URL: http://www.onsemi.cn/pub_link/Collateral/MM3Z2V4T1-D.PDF; DatasheetVersion: Rev. 9; PackageReference: SOD-323-2-477-02; ComponentLink3URL: http://www.onsemi.com/pub_link/Collateral/477-02.PDF.1; Packing: Tape and Reel; Mounting Technology: Surface Mount; ComponentLink3Description: Package Specification; PackageDescription: 2-Pin SOD, Body 1.7 x 1.25 mm; ComponentLink1Description: Manufacturer URL
Q7 = CMP-013-00040-1: as Q17 on sheet 3V3Primary; Pins: 5; RoHS Compliant: Yes; Max Operating Temperature: 150°C
Q9 = CMP-013-00041-1: as Q18 on sheet 3V3Primary; Max Operating Temperature: 150°C; RoHS Compliant: Yes; Pins: 3
R43 R44#2 = CMP-009-00192-1: as R106 on sheet 3V3Primary; RoHS Compliant: Yes; Max Operating Temperature: 155°C; Case/Package: 1210; Min Operating Temperature: -55°C; Mounting Technology: Surface Mount; Tolerance: 5%; Pins: 2
R49 R50 = CMP-009-00152-3: as R104 on sheet 3V3Primary; Pins: 2; Max Operating Temperature: 155°C; Min Operating Temperature: -55°C; Case/Package: 0402
R51 = CMP-26527-000133-1: as R103 on sheet 3V3Primary; Lead Free: Lead Free; Military Standard: Not; Case Code (Imperial): 1206; Max Operating Temperature: 155°C; Case Code (Metric): 3216; Height: 0.026inch; Packaging: Tape and Reel; Case/Package: 1206; Series: CSR; Number of Terminations: 2; RoHS Compliant: Yes; Mount: Surface Mount; Depth: 1.55mm; Contact Plating: Tin; Length: 0.12inch; Radiation Hardening: No; Width: 0.061inch; Size Code: 1206; Power Rating: 500mW; Min Operating Temperature: -55°C; Tolerance: 1%; Resistor Type: Thick Film; Construction: Rectangular
R56 = CMP-009-00195-1: Fixed Resistor, Metal Glaze/thick Film, 0.25W, 7500ohm, 200V, 1% +/-Tol, 100ppm/Cel, Surface Mount, 1206; Power: 250mW; RoHS Compliant: Yes; Pins: 2; Tolerance: 1%; Min Operating Temperature: -55°C; Max Operating Temperature: 155°C; Case/Package: 1206; Mounting Technology: Surface Mount
R57 = CMP-009-00110-2: 768K 0.063W 1% 0402 (1005 Metric)  SMD; Power: 63mW; Tolerance: 1%; Mounting Technology: SMT; Pins: 2; Case/Package: 0402
R58 = CMP-009-00193-1: Fixed Resistor, Thin Film, 0.25W, 150000ohm, 200V, 1% +/-Tol, 50ppm/Cel, Surface Mount, 1206; Power: 250mW; Pins: 2; Case/Package: 1206; Tolerance: 1%; Mounting Technology: Surface Mount; Max Operating Temperature: 155°C; RoHS Compliant: Yes; Min Operating Temperature: -55°C
R59 = CMP-009-00194-1: Fixed Resistor, Thin Film, 0.15W, 80000ohm, 75V, 0.1% +/-Tol, 25ppm/Cel, Surface Mount, 0603; Power: 150mW; Case/Package: 0603; RoHS Compliant: Yes; Pins: 2; Mounting Technology: Surface Mount; Max Operating Temperature: 150°C; Tolerance: 0.1%; Min Operating Temperature: -55°C
U20 = CMP-010-00025-1: as U27 on sheet 3V3Primary; Case/Package: LSSOP; Max Operating Temperature: 125°C; Min Operating Temperature: -40°C; Pins: 8; RoHS Compliant: Yes
U25#1 = CMP-019-00049-1: Switching Controller, CMOS, PQCC12; Max Supply Voltage: 36V; Pins: 12; Min Operating Temperature: -40°C; Case/Package: HVQCCN; RoHS Compliant: Yes; Max Operating Temperature: 85°C

## Sheet 5VSecondary.SchDoc
size A; SheetNumber: 12; SheetTotal: 18
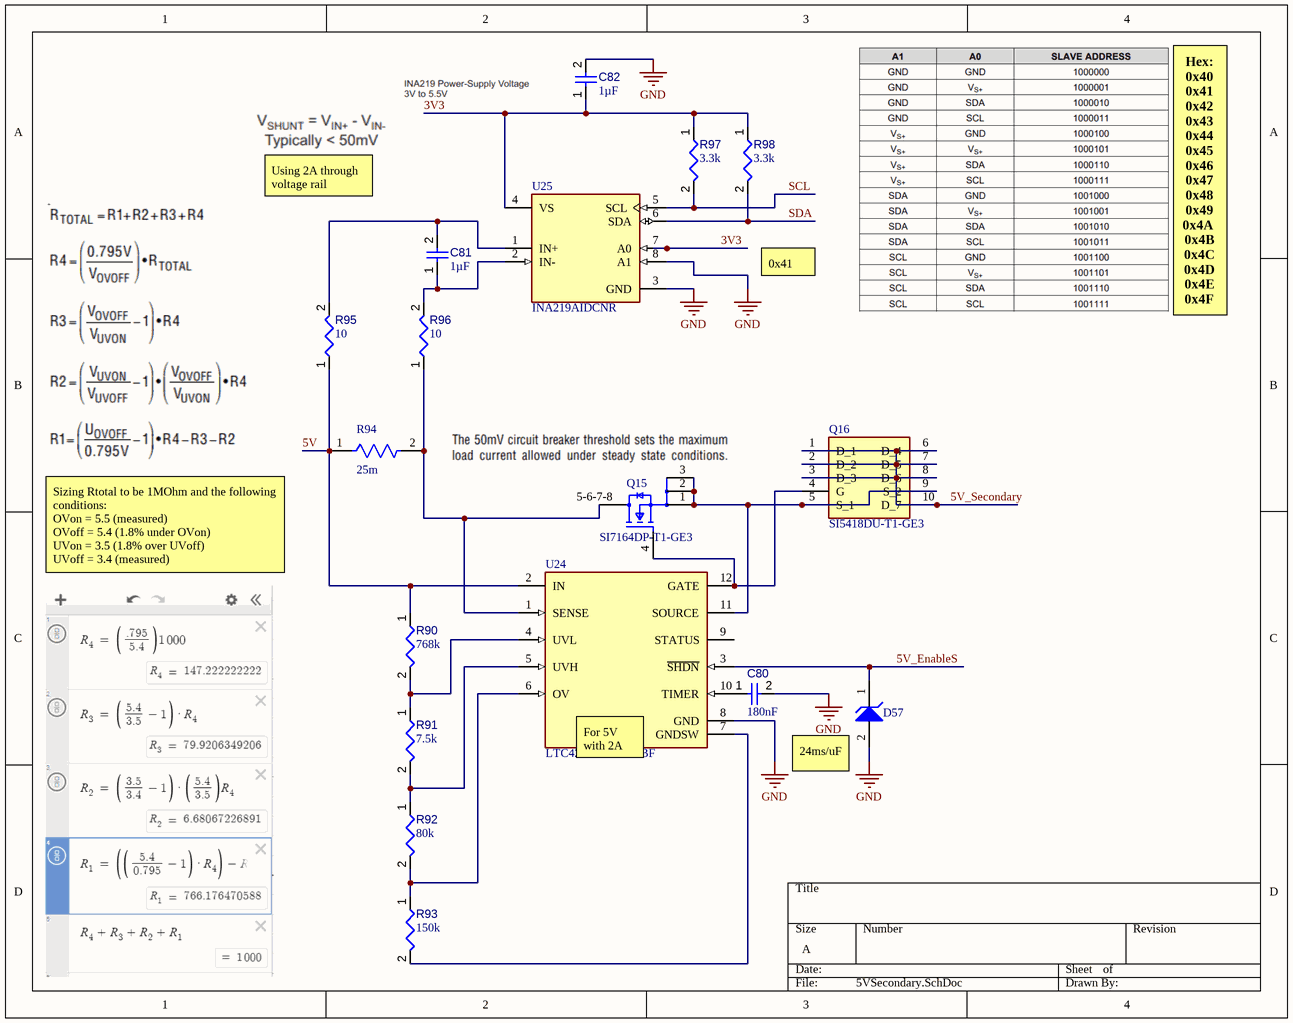
[diagram p5: 5VSecondary.SchDoc]

### Parts
(Parts that share a designator on the sheet are numbered #1, #2 ... from top to bottom, then left to right.)
C80  value 180nF  [FP-C0805C-DN-IPC_A]  (hidden comment: C0805C184K5RACTU)
C81  value 1µF  [CAPC1608X90X40LL10T20]  (hidden comment: Capacitor 1 uF +/- 10% 25 V 0603)
C82  value 1µF  [CAPC1608X90X35ML15T15]  (hidden comment: Capacitor 1uF +/- 10% 16V 0603)
D57  MM3Z3V6T1G  [ONSC-SOD-323-2-477-02_V]  (value not drawn)
Q15  SI7164DP-T1-GE3  [Vishay_S17-0173-SINGLE_MFG]
Q16  SI5418DU-T1-GE3  [SI5418DU-T1-GE3-Footprint-1]
R90  value 768k  [RESC0402(1005)_L]  (hidden comment: 768KR2F)
R91  value 7.5k  [FP-CRCW1206-e3-IPC_A]  (hidden comment: CRCW12067K50FKEA)
R92  value 80k  [FP-PTN0603-IPC_B]  (hidden comment: PTN0603E8002BST1)
R93  value 150k  [FP-RT1206-IPC_C]  (hidden comment: RT1206FRE07150KL)
R94  Resistance: 25m  [FP-CSR1206-IPC_C]  (hidden comment: CSR1206FK25L0)
R95  value 10  [RESC0402(1005)_L]  (hidden comment: Resistor 10R  +/-1 % 0402 63 mW)
R96  value 10  [RESC0402(1005)_L]  (hidden comment: Resistor 10R  +/-1 % 0402 63 mW)
R97  value 3.3k  [FP-CRCW1210-e3-IPC_C]  (hidden comment: CRCW12103K30JNEA)
R98  value 3.3k  [FP-CRCW1210-e3-IPC_C]  (hidden comment: CRCW12103K30JNEA)
U24  LTC4231HMS-1#PBF  [FP-MS-12-05-08-1668-MFG]
U25#2  INA219AIDCNR  [FP-DCN0008A-IPC_A]

### Nets
GND: C80.2 C82.2 D57.2(A) U24.8(GND) U25#2.3(GND) U25#2.8(A1)
3V3: C82.1 R97.1 R98.1 U25#2.4(VS) U25#2.7(A0)
5V: R90.1 R94.1 R95.1 U24.2(IN)
5V_EnableS: D57.1(K) U24.3(~{SHDN})
5V_Secondary: Q16.1(D_1) Q16.2(D_2) Q16.3(D_3) Q16.6(D_4) Q16.7(D_5) Q16.8(D_6) Q16.10(D_7)
SCL: R97.2 U25#2.5(SCL)
SDA: R98.2 U25#2.6(SDA)
NetC80_1: C80.1 U24.10(TIMER)
NetC81_1: C81.1 R96.2 U25#2.2(IN-)
NetC81_2: C81.2 R95.2 U25#2.1(IN+)
NetQ15_1: Q15.1(S) Q15.2(S) Q15.3(S) Q16.5(S_1) Q16.9(S_2) U24.11(SOURCE)
NetQ15_4: Q15.4(G) Q16.4(G) U24.12(GATE)
NetQ15_5-6-7-8: Q15.5-6-7-8(D) R94.2 R96.1 U24.1(SENSE)
NetR90_2: R90.2 R91.1 U24.4(UVL)
NetR91_2: R91.2 R92.1 U24.5(UVH)
NetR92_2: R92.2 R93.1 U24.6(OV)
NetR93_2: R93.2 U24.7(GNDSW)

Not connected (* = marked no-connect by the designer): U24 9(STATUS)

### Notes on the sheet
- Using 2A through voltage rail
- 0x41
- Hex:
  0x40
  0x41
  0x42
  0x43
  0x44
  0x45
  0x46
  0x47
  0x48
  0x49
  0x4A
  0x4B
  0x4C
  0x4D
  0x4E
  0x4F
- Sizing Rtotal to be 1MOhm and the following conditions:
  OVon = 5.5 (measured)
  OVoff = 5.4 (1.8% under OVon)
  UVon = 3.5 (1.8% over UVoff)
  UVoff = 3.4 (measured)
- (near U24) For 5V
  with 2A
- (near D57) 24ms/uF

### Library data of the parts
C80 = CMP-001-00086-1: as C83 on sheet 3V3Primary; Capacitor Type: Ceramic; Mounting Technology: Surface Mount; Pins: 2; Min Operating Temperature: -55°C; Case/Package: 0805; Max Operating Temperature: 125°C; RoHS Compliant: Yes
C81 = CMP-001-00005-6: as C84 on sheet 3V3Primary; Pins: 2; Mounting Technology: SM; RoHS Compliant: True; Max Operating Temperature: 125°C; Case/Package: 0603; Min Operating Temperature: -55°C; Tolerance: 10%
C82 = CMP-001-00004-6: as C85 on sheet 3V3Primary; Mounting Technology: SM; RoHS Compliant: True; Min Operating Temperature: -55°C; Case/Package: 0603; Pins: 2; Voltage Rating: 16V; Max Operating Temperature: 125°C; Tolerance: 10%
D57 = CMP-1060-00650-1: as D58 on sheet 3V3Primary; RoHS: Pb-Free; ComponentLink1URL: http://www.onsemi.com/; PackageVersion: Rev. H, 03/2007; PartNumber: MM3Z3V6T1G; ComponentLink2Description: Datasheet; ComponentLink2URL: http://www.onsemi.cn/pub_link/Collateral/MM3Z2V4T1-D.PDF; DatasheetVersion: Rev. 9; PackageReference: SOD-323-2-477-02; ComponentLink3URL: http://www.onsemi.com/pub_link/Collateral/477-02.PDF.1; Packing: Tape and Reel; Mounting Technology: Surface Mount; ComponentLink3Description: Package Specification; PackageDescription: 2-Pin SOD, Body 1.7 x 1.25 mm; ComponentLink1Description: Manufacturer URL
Q15 = CMP-013-00040-1: as Q17 on sheet 3V3Primary; Pins: 5; RoHS Compliant: Yes; Max Operating Temperature: 150°C
Q16 = CMP-013-00041-1: as Q18 on sheet 3V3Primary; Max Operating Temperature: 150°C; RoHS Compliant: Yes; Pins: 3
R90 = CMP-009-00110-2: as R57 on sheet 5VPrimary; Tolerance: 1%; Mounting Technology: SMT; Pins: 2; Case/Package: 0402
R91 = CMP-009-00195-1: as R56 on sheet 5VPrimary; RoHS Compliant: Yes; Pins: 2; Tolerance: 1%; Min Operating Temperature: -55°C; Max Operating Temperature: 155°C; Case/Package: 1206; Mounting Technology: Surface Mount
R92 = CMP-009-00194-1: as R59 on sheet 5VPrimary; Case/Package: 0603; RoHS Compliant: Yes; Pins: 2; Mounting Technology: Surface Mount; Max Operating Temperature: 150°C; Tolerance: 0.1%; Min Operating Temperature: -55°C
R93 = CMP-009-00193-1: as R58 on sheet 5VPrimary; Pins: 2; Case/Package: 1206; Tolerance: 1%; Mounting Technology: Surface Mount; Max Operating Temperature: 155°C; RoHS Compliant: Yes; Min Operating Temperature: -55°C
R94 = CMP-26527-000133-1: as R103 on sheet 3V3Primary; Lead Free: Lead Free; Military Standard: Not; Case Code (Imperial): 1206; Max Operating Temperature: 155°C; Case Code (Metric): 3216; Height: 0.026inch; Packaging: Tape and Reel; Case/Package: 1206; Series: CSR; Number of Terminations: 2; RoHS Compliant: Yes; Mount: Surface Mount; Depth: 1.55mm; Contact Plating: Tin; Length: 0.12inch; Radiation Hardening: No; Width: 0.061inch; Size Code: 1206; Power Rating: 500mW; Min Operating Temperature: -55°C; Tolerance: 1%; Resistor Type: Thick Film; Construction: Rectangular
R95 R96 = CMP-009-00152-3: as R104 on sheet 3V3Primary; Pins: 2; Max Operating Temperature: 155°C; Min Operating Temperature: -55°C; Case/Package: 0402
R97 R98 = CMP-009-00192-1: as R106 on sheet 3V3Primary; RoHS Compliant: Yes; Max Operating Temperature: 155°C; Case/Package: 1210; Min Operating Temperature: -55°C; Mounting Technology: Surface Mount; Tolerance: 5%; Pins: 2
U24 = CMP-09134-000012-1: as U26 on sheet 3V3Primary; Number of Pins: 12; Features: Latched Fault; Max Operating Temperature: 125°C; Mount: Surface Mount; Packaging: Rail/Tube; Min Operating Temperature: -40°C; REACH SVHC: No SVHC; Case/Package: MSOP; RoHS Compliant: Yes
U25#2 = CMP-010-00025-1: as U27 on sheet 3V3Primary; Case/Package: LSSOP; Max Operating Temperature: 125°C; Min Operating Temperature: -40°C; Pins: 8; RoHS Compliant: Yes

## Sheet MemoryLatch.SchDoc
size A; SheetNumber: 18; SheetTotal: 18
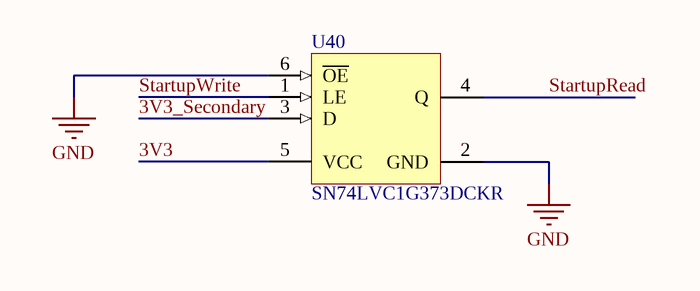
[diagram p6: MemoryLatch.SchDoc]

### Parts
U40  SN74LVC1G373DCKR  [DCK0006A_M]

### Nets
GND: U40.2(GND) U40.6(~{OE})
3V3: U40.5(VCC)
3V3_Secondary: U40.3(D)
StartupRead: U40.4(Q)
StartupWrite: U40.1(LE)

### Library data of the parts
U40 = CMP-019-00050-1: Bus Driver, LVC/LCX/Z Series, 1-Func, 1-Bit, True Output, CMOS, PDSO6; Min Supply Voltage: 1.65V; Max Supply Voltage: 5.5V; RoHS Compliant: Yes; Min Operating Temperature: -40°C; Case/Package: TSSOP; Max Operating Temperature: 125°C; Pins: 6